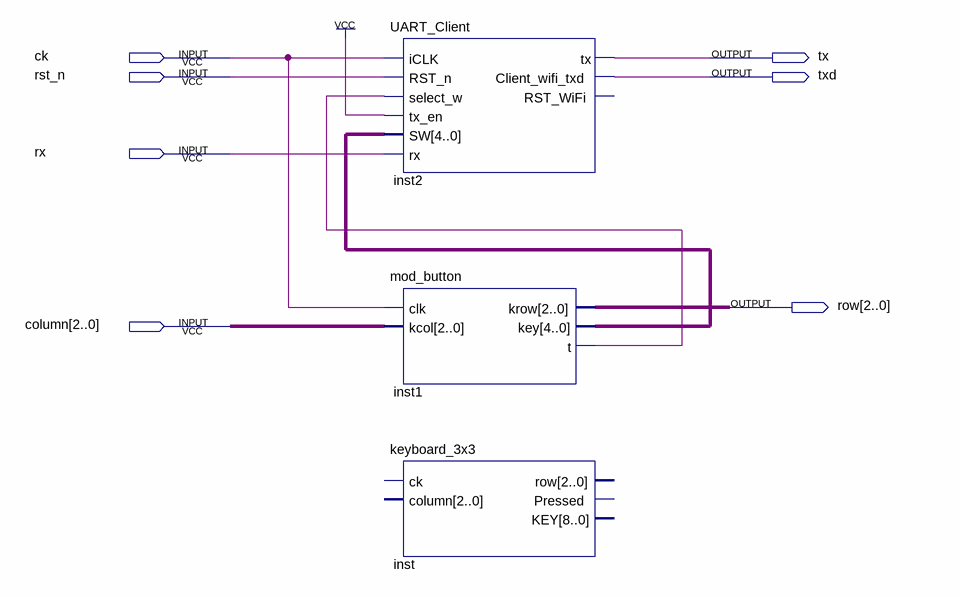
[diagram p0: schematic sheet]
// Quartus schematic top.bdf as structural Verilog: 3 symbols, 7 pins
module top (
  input  ck,
  input  rst_n,
  input  rx,
  input  [2:0] column,
  output tx,
  output txd,
  output [2:0] row
);

  wire inst1_t;
  wire [4:0] inst1_key;

  UART_Client inst2 (
    .iCLK(ck), .RST_n(rst_n), .select_w(inst1_t), .tx_en(1'b1), .SW(inst1_key), .rx(rx), .tx(tx),
    .Client_wifi_txd(txd));  // open: RST_WiFi
  mod_button inst1 (.clk(ck), .kcol(column), .krow(row), .key(inst1_key), .t(inst1_t));
  keyboard_3x3 inst ();  // open: ck, column, row, Pressed, KEY
endmodule
